# Altium project DBL.PrjPcb
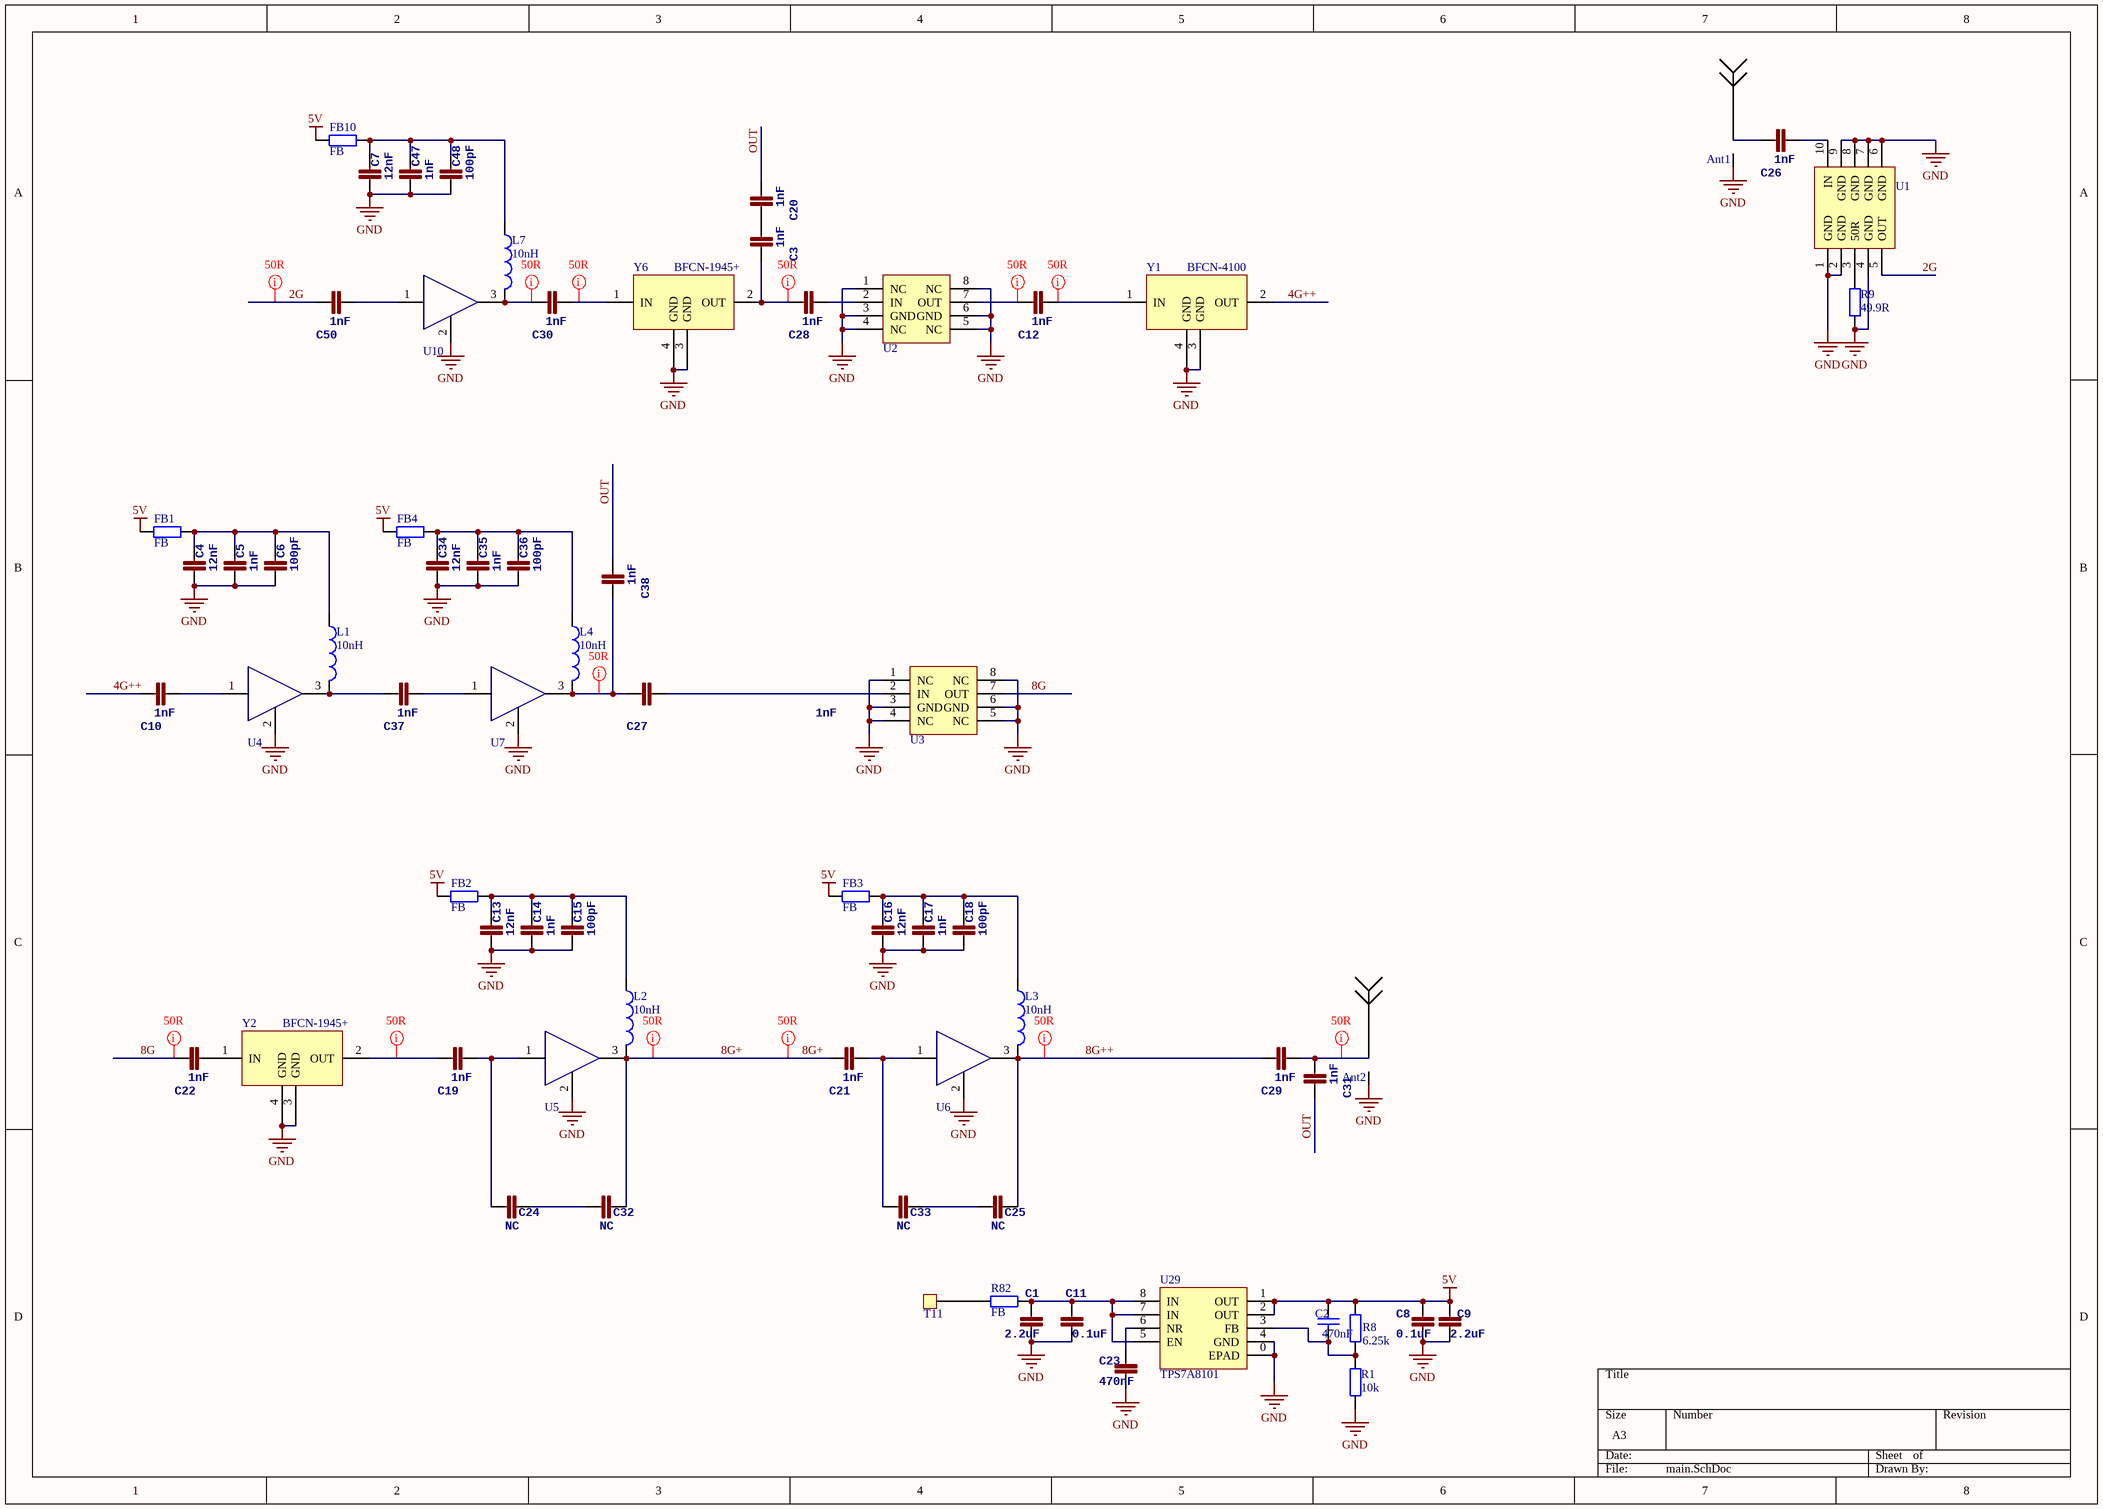
[diagram p0: main.SchDoc]
1 sheet, 70 parts. Net scope: global (net labels, ports and power ports of the same name join across sheets).
Board file: DBL.PcbDoc

## Sheet main.SchDoc
size A3

### Parts
Ant1  Antenna  [SMA-2]  (value not drawn)
Ant2  Antenna  [SMA-2]  (value not drawn)
C1  2.2uF  [0603]
C2  470nF  [0402]
C3  1nF  [0603L]
C4  12nF  [0805]
C5  1nF  [0402]
C6  100pF  [0402]
C7  12nF  [0805]
C8  0.1uF  [0603]
C9  2.2uF  [0603]
C10  1nF  [0603L]
C11  0.1uF  [0402]
C12  1nF  [0603L]
C13  12nF  [0805]
C14  1nF  [0402]
C15  100pF  [0402]
C16  12nF  [0805]
C17  1nF  [0402]
C18  100pF  [0402]
C19  1nF  [0603L]
C20  1nF  [0603L]
C21  1nF  [0603L]
C22  1nF  [0603L]
C23  470nF  [0402]
C24  NC  [0402]
C25  NC  [0402]
C26  1nF  [0603L]
C27  1nF  [0603L]
C28  1nF  [0603L]
C29  1nF  [0603L]
C30  1nF  [0603L]
C31  1nF  [0603L]
C32  NC  [0402]
C33  NC  [0402]
C34  12nF  [0805]
C35  1nF  [0402]
C36  100pF  [0402]
C37  1nF  [0603L]
C38  1nF  [0603L]
C47  1nF  [0402]
C48  100pF  [0402]
C50  1nF  [0603L]
FB1  FB  [0603]
FB2  FB  [0603]
FB3  FB  [0603]
FB4  FB  [0603]
FB10  FB  [0603]
L1  value 10nH  [0402]  (hidden comment: Inductor)
L2  value 10nH  [0402]  (hidden comment: Inductor)
L3  value 10nH  [0402]  (hidden comment: Inductor)
L4  value 10nH  [0402]  (hidden comment: Inductor)
L7  value 10nH  [0402]  (hidden comment: Inductor)
R1  10k  [0402]
R8  6.25k  [0402]
R9  49.9R  [0402]
R82  FB  [0603L]
T11  TestPad  [TestPad - 1mm]  (value not drawn)
U1  KC2-11+  [DZ885]  (value not drawn)
U2  HMC189  [MSOP8/VSSOP8]  (value not drawn)
U3  HMC189  [MSOP8/VSSOP8]  (value not drawn)
U4  AMP-SOT89  [SOT-89]  (value not drawn)
U5  AMP-SOT89  [SOT-89]  (value not drawn)
U6  AMP-SOT89  [SOT-89]  (value not drawn)
U7  AMP-SOT89  [SOT-89]  (value not drawn)
U10  AMP-SOT89  [SOT-89]  (value not drawn)
U29  TPS7A8101  [TPS7A8101]
Y1  BFCN-4100  [1748LP18A075]
Y2  BFCN-1945+  [1748LP18A075]
Y6  BFCN-1945+  [1748LP18A075]

### Nets
5V: C2.1 C8.2 C9.2 FB1.1 FB2.1 FB3.1 FB4.1 FB10.1 R8.1 U29.1(OUT) U29.2(OUT)
GND: Ant1.GND(G) Ant2.GND(G) C1.1 C4.1 C5.1 C6.1 C7.1 C8.1 C9.1 C11.1 C13.1 C14.1 C15.1 C16.1 C17.1 C18.1 C23.1 C34.1 C35.1 C36.1 C47.1 C48.1 R1.2 R9.1 U1.1(GND) U1.2(GND) U1.4(GND) U1.6(GND) U1.7(GND) U1.8(GND) U1.9(GND) U2.1(NC) U2.3(GND) U2.4(NC) U2.5(NC) U2.6(GND) U2.8(NC) U3.1(NC) U3.3(GND) U3.4(NC) U3.5(NC) U3.6(GND) U3.8(NC) U4.2 U5.2 U6.2 U7.2 U10.2 U29.0(EPAD) U29.4(GND) Y1.3(GND) Y1.4(GND) Y2.3(GND) Y2.4(GND) Y6.3(GND) Y6.4(GND)
2G: C50.1 U1.5(OUT)
4G++: C10.1 Y1.2(OUT)
8G: C22.1 U3.7(OUT)
8G+: C21.1 C32.2 L2.2 U5.3
8G++: C25.2 C29.1 L3.2 U6.3
OUT: C20.2 C31.1 C38.2
NetAnt1_1: Ant1.1 C26.1
NetAnt2_1: Ant2.1 C29.2 C31.2
NetC1_2: C1.2 C11.2 R82.1 U29.5(EN) U29.7(IN) U29.8(IN)
NetC2_2: C2.2 R1.1 R8.2 U29.3(FB)
NetC3_1: C3.1 C28.1 Y6.2(OUT)
NetC3_2: C3.2 C20.1
NetC4_2: C4.2 C5.2 C6.2 FB1.2 L1.1
NetC7_2: C7.2 C47.2 C48.2 FB10.2 L7.1
NetC10_2: C10.2 U4.1
NetC12_1: C12.1 U2.7(OUT)
NetC12_2: C12.2 Y1.1(IN)
NetC13_2: C13.2 C14.2 C15.2 FB2.2 L2.1
NetC16_2: C16.2 C17.2 C18.2 FB3.2 L3.1
NetC19_1: C19.1 Y2.2(OUT)
NetC19_2: C19.2 C24.1 U5.1
NetC21_2: C21.2 C33.1 U6.1
NetC22_2: C22.2 Y2.1(IN)
NetC23_2: C23.2 U29.6(NR)
NetC24_2: C24.2 C32.1
NetC25_1: C25.1 C33.2
NetC26_2: C26.2 U1.10(IN)
NetC27_1: C27.1 C38.1 L4.2 U7.3
NetC27_2: C27.2 U3.2(IN)
NetC28_2: C28.2 U2.2(IN)
NetC30_1: C30.1 L7.2 U10.3
NetC30_2: C30.2 Y6.1(IN)
NetC34_2: C34.2 C35.2 C36.2 FB4.2 L4.1
NetC37_1: C37.1 L1.2 U4.3
NetC37_2: C37.2 U7.1
NetC50_2: C50.2 U10.1
NetR9_2: R9.2 U1.3(50R)
NetR82_2: R82.2 T11.1

### Layout directives
net class 50R: 2G, 8G, 8G+, 8G++, NetAnt2_1, NetC3_1, NetC12_1, NetC12_2, NetC19_1, NetC27_1, NetC30_1, NetC30_2

### Library data of the parts
C1 C3-C38 C47 C48 C50 = CAP0402-CAP: <b>Capacitor</b> / Standard 0603 ceramic capacitor, and 0.1" leaded capacitor.; PARTNO: CC0402ZRY5V7BB104
C2 = Cap: Capacitor; Published: 8-Jun-2000; LatestRevisionDate: 17-Jul-2002; LatestRevisionNote: Re-released for DXP Platform.; PackageReference: RAD-0.3; Publisher: Altium Limited; PackageDescription: Radial Cap, Thru-Hole; 2 Leads; 0.3 in Pin Spacing
FB1-FB4 FB10 = Res2: Resistor; Published: 8-Jun-2000; LatestRevisionDate: 17-Jul-2002; LatestRevisionNote: Re-released for DXP Platform.; PackageReference: AXIAL-0.4; Publisher: Altium Limited; PackageDescription: Axial Device, Thru-Hole; 2 Leads; 0.4 in Pin Spacing
L1-L4 L7 = Inductor: Code_IEC: 1005; Published: 8-Jun-2000; LatestRevisionDate: 29-May-2009; LatestRevisionNote: IPC-7351 Footprint Added.; PackageReference: 0402-A; Publisher: Altium Limited; PackageDescription: Chip Inductor; Code_JEITA: 0402
R1 R8 R9 R82 = Res2: Resistor; Value: 0Ohm; Published: 8-Jun-2000; LatestRevisionDate: 17-Jul-2002; LatestRevisionNote: Re-released for DXP Platform.; PackageReference: AXIAL-0.4; Publisher: Altium Limited; PackageDescription: Axial Device, Thru-Hole; 2 Leads; 0.4 in Pin Spacing
Y1 Y2 Y6 = 1748LP18A075